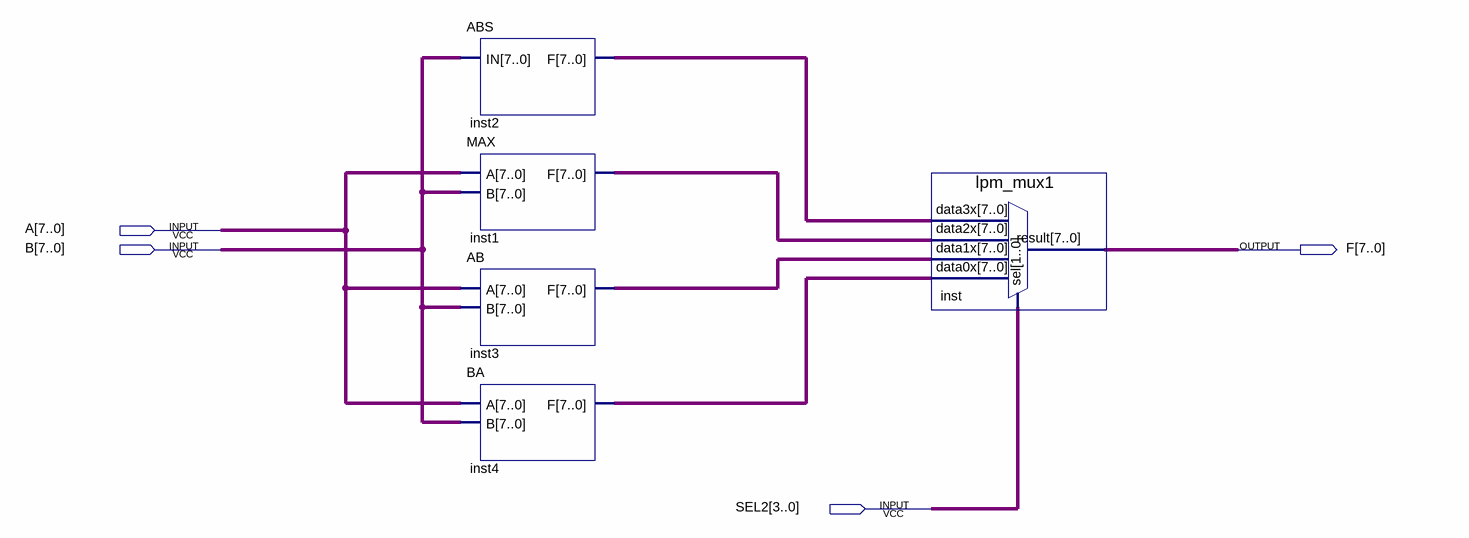
[diagram p0: schematic sheet]
// Quartus schematic ALU4.bdf as structural Verilog: 5 symbols, 4 pins
module ALU4 (
  input  [7:0] A,
  input  [7:0] B,
  input  [3:0] SEL2,
  output [7:0] F
);

  wire [7:0] inst1_f, inst2_f, inst3_f, inst4_f;

  ABS inst2 (.IN(B), .F(inst2_f));
  MAX inst1 (.A(A), .B(B), .F(inst1_f));
  AB inst3 (.A(A), .B(B), .F(inst3_f));
  BA inst4 (.A(A), .B(B), .F(inst4_f));
  lpm_mux1 inst (.data3x(inst2_f), .data2x(inst1_f), .data1x(inst3_f), .data0x(inst4_f), .sel(SEL2), .result(F));
endmodule
